# Altium schematic sheet R3Change.SchDoc
size A4
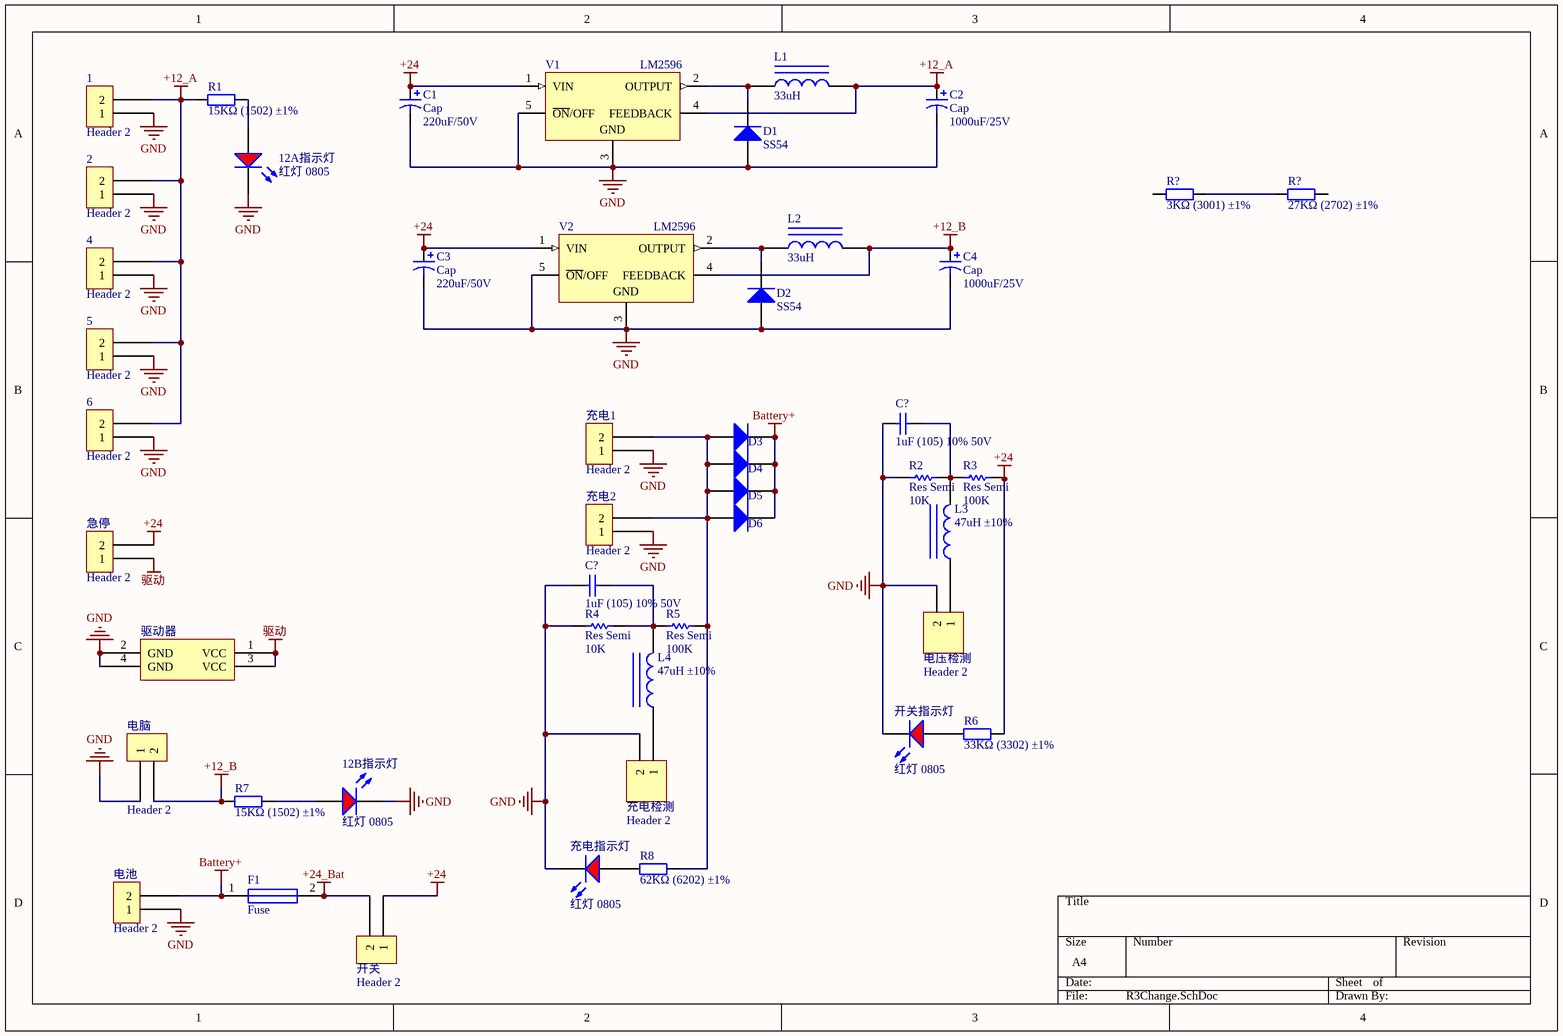
[diagram p0: R3Change.SchDoc]

## Parts
(Parts that share a designator on the sheet are numbered #1, #2 ... from top to bottom, then left to right.)
1  Header 2  [VH-2A]
2  Header 2  [VH-2A]
4  Header 2  [VH-2A]
5  Header 2  [VH-2A]
6  Header 2  [VH-2A]
12A指示灯  红灯 0805  [LC-0805_LED_S1]
12B指示灯  红灯 0805  [LC-0805_LED_S1]
C1  Cap  value 220uF/50V  [Cap_5.0]
C2  Cap  value 1000uF/25V  [Cap_5.0]
C3  Cap  value 220uF/50V  [Cap_5.0]
C4  Cap  value 1000uF/25V  [Cap_5.0]
C?#1  1uF (105) 10% 50V  [LC-0603_C]
C?#2  1uF (105) 10% 50V  [LC-0603_C]
D1  SS54  [LC-SMA(DO-214AC)_S1]
D2  SS54  [LC-SMA(DO-214AC)_S1]
D3  Diode 1N5408  [DO-201AD]  (value not drawn)
D4  Diode 1N5408  [DO-201AD]  (value not drawn)
D5  Diode 1N5408  [DO-201AD]  (value not drawn)
D6  Diode 1N5408  [DO-201AD]  (value not drawn)
F1  Fuse  [Fuse]
L1  33uH  [Inductor]
L2  33uH  [Inductor]
L3  47uH ±10%  [LC-0805_L]
L4  47uH ±10%  [LC-0805_L]
R1  15KΩ (1502) ±1%  [LC-0805_R]
R2  Res Semi  value 10K  [AXIAL-0.5]
R3  Res Semi  value 100K  [AXIAL-0.5]
R4  Res Semi  value 10K  [AXIAL-0.5]
R5  Res Semi  value 100K  [AXIAL-0.5]
R6  33KΩ (3302) ±1%  [LC-0805_R]
R7  15KΩ (1502) ±1%  [LC-0805_R]
R8  62KΩ (6202) ±1%  [LC-0805_R]
R?#1  3KΩ (3001) ±1%  [LC-0805_R]
R?#2  27KΩ (2702) ±1%  [LC-0805_R]
V1  LM2596  [LC-TO-220-5]
V2  LM2596  [LC-TO-220-5]
充电1  Header 2  [VH-2A]
充电2  Header 2  [VH-2A]
充电指示灯  红灯 0805  [LC-0805_LED_S1]
充电检测  Header 2  [HDR1X2]
开关  Header 2  [VH-2A]
开关指示灯  红灯 0805  [LC-0805_LED_S1]
急停  Header 2  [VH-2A]
电压检测  Header 2  [HDR1X2]
电池  Header 2  [VH-2A]
电脑  Header 2  [VH-2A]
驱动器  插座  [HEADER 2X2]  (value not drawn)

## Nets
+12_A: 1.2 2.2 4.2 5.2 6.2 C2.1 L1.2 R1.1 V1.4(FEEDBACK)
+12_B: C4.1 L2.2 R7.1 V2.4(FEEDBACK) 电脑.2
+24: C1.1 C3.1 R3.2 R6.2 V1.1(VIN) V2.1(VIN) 开关.1 急停.2
+24_Bat: F1.2(K) 开关.2
Battery+: D3.2(K) D4.2(K) D5.2(K) D6.2(K) F1.1(A) 电池.2
GND: 1.1 2.1 4.1 5.1 6.1 12A指示灯.K 12B指示灯.K C1.2 C2.2 C3.2 C4.2 C?#1.1 C?#2.1 D1.1(A) D2.1(A) R2.1 R4.1 V1.3(GND) V1.5(~{ON}/OFF) V2.3(GND) V2.5(~{ON}/OFF) 充电1.1 充电2.1 充电指示灯.K 充电检测.2 开关指示灯.K 电压检测.2 电池.1 电脑.1 驱动器.2(GND) 驱动器.4(GND)
驱动: 急停.1 驱动器.1(VCC) 驱动器.3(VCC)
Net12A指示灯_A: 12A指示灯.A R1.2
Net12B指示灯_A: 12B指示灯.A R7.2
NetC?#1_2: C?#1.2 L3.2 R2.2 R3.1
NetC?#2_2: C?#2.2 L4.2 R4.2 R5.1
NetD1_2: D1.2(K) L1.1 V1.2(OUTPUT)
NetD2_2: D2.2(K) L2.1 V2.2(OUTPUT)
NetD3_1: D3.1(A) D4.1(A) D5.1(A) D6.1(A) R5.2 R8.2 充电1.2 充电2.2
NetL3_1: L3.1 电压检测.1
NetL4_1: L4.1 充电检测.1
NetR6_1: R6.1 开关指示灯.A
NetR8_1: R8.1 充电指示灯.A
NetR?#1_2: R?#1.2 R?#2.1

Not connected (* = marked no-connect by the designer): R?#1 1; R?#2 2

## Library data of the parts
1 2 4-6 充电1 充电2 开关 急停 电池 电脑 = Header 2: 贴片2p座
12A指示灯 12B指示灯 充电指示灯 开关指示灯 = 0805 红灯: 发光二极管; ComponentLink1Description: 供应商链接; ComponentLink1URL: http://www.szlcsc.com/product/details_2668.html; Package: 0805; Supplier: LC; SuppliersPartNumber: C2295
C1-C4 = Cap_DIP
C?#1 C?#2 = 0603 1uF (105) 10% 50V: 贴片电容; ComponentLink1Description: 供应商链接; ComponentLink1URL: http://www.szlcsc.com/product/details_16531.html; Package: 0603; Supplier: LC; SuppliersPartNumber: C15849
D1 D2 = SMA(DO-214AC) SS54: 二极管; ComponentLink1Description: 供应商链接; ComponentLink1URL: http://www.szlcsc.com/product/details_23178.html; Package: SMA(DO-214AC); Supplier: LC; SuppliersPartNumber: C22452
D3-D6 = Diode 1N5408: 3 Amp Medium Power Silicon Rectifier Diode; Published: 8-Jun-2000; LatestRevisionDate: 17-Jul-2002; LatestRevisionNote: Re-released for DXP Platform.; DatasheetVersion: Aug-1984; PackageReference: DO-201AD; Publisher: Altium Limited; PackageDescription: Diode, Axial; Body 9.5 x 5.3 mm (LxDia. max), Lead Dia. 1.32 mm (max); ComponentLink1Description: Manufacturer Link; ComponentLink1URL: http://www.irf.com/
F1 = FUSE: Fuse-DIP
L1 L2 = Inducotor
L3 L4 = 0805 47uH 10%: 贴片电感; ComponentLink1Description: 供应商链接; ComponentLink1URL: http://www.szlcsc.com/product/details_14964.html; Package: 0805; Supplier: LC; SuppliersPartNumber: C14304
R1 R7 = 0805 15KΩ (1502) 1%: 贴片电阻; ComponentLink1Description: 供应商链接; ComponentLink1URL: http://www.szlcsc.com/product/details_18163.html; Package: 0805; Supplier: LC; SuppliersPartNumber: C17475
R2-R5 = Res Semi: Semiconductor Resistor; Published: 8-Jun-2000; LatestRevisionDate: 17-Jul-2002; LatestRevisionNote: Re-released for DXP Platform.; PackageReference: AXIAL-0.5; Publisher: Altium Limited; PackageDescription: Axial Device, Thru-Hole; 2 Leads; 0.5 in Pin Spacing
R6 = 0805 33KΩ (3302) 1%: 贴片电阻; ComponentLink1Description: 供应商链接; ComponentLink1URL: http://www.szlcsc.com/product/details_18321.html; Package: 0805; Supplier: LC; SuppliersPartNumber: C17633
R8 = 0805 62KΩ (6202) 1%: 贴片电阻; ComponentLink1Description: 供应商链接; ComponentLink1URL: http://www.szlcsc.com/product/details_18471.html; Package: 0805; Supplier: LC; SuppliersPartNumber: C17783
R?#1 = 0805 3KΩ (3001) 1%: 贴片电阻; ComponentLink1Description: 供应商链接; ComponentLink1URL: http://www.szlcsc.com/product/details_18349.html; Package: 0805; Supplier: LC; SuppliersPartNumber: C17661
R?#2 = 0805 27KΩ (2702) 1%: 贴片电阻; ComponentLink1Description: 供应商链接; ComponentLink1URL: http://www.szlcsc.com/product/details_18281.html; Package: 0805; Supplier: LC; SuppliersPartNumber: C17593
V1 V2 = LM2596: Power Chip
充电检测 电压检测 = Header 2: Header, 2-Pin; LatestRevisionDate: 17-Jul-2002; LatestRevisionNote: Re-released for DXP Platform.; Publisher: Altium Limited
驱动器 = HEADER_2X2